# EAGLE design despertador (EAGLE 9.6.2)
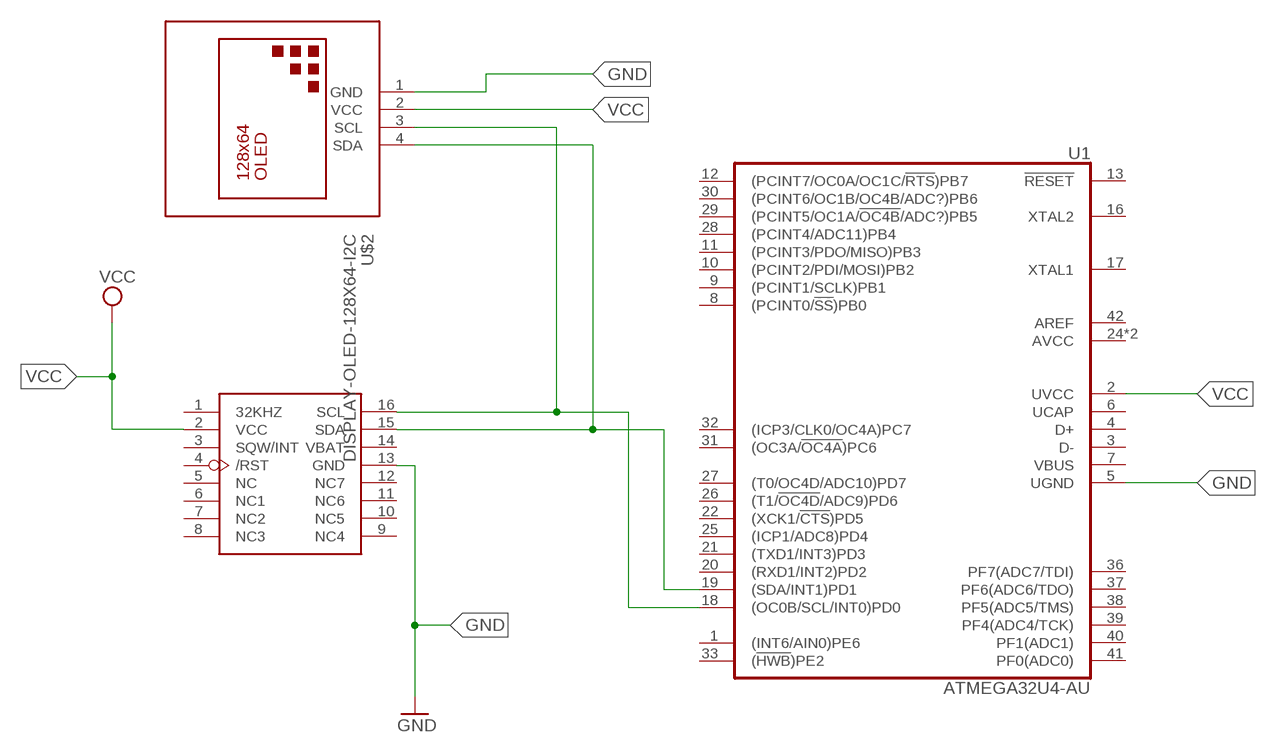
[diagram p0: schematic, sheet 1]

## Parts
U1  ATMEGA32U4-AU  [QFP44_10X10_0.80]
U$1  DS3231  [PDIP]
U$2  DISPLAY-OLED-128X64-I2C  [DISPLAY-OLED-128X64-I2C]

## Nets
GND: U1.5(UGND) U$1.13(GND) U$2.1(GND)
N$1: U1.18((OC0B/SCL/INT0)PD0) U$1.16(SCL) U$2.3(SCL)
N$2: U1.19((SDA/INT1)PD1) U$1.15(SDA) U$2.4(SDA)
VCC: U1.2(UVCC) U$1.2(VCC) U$2.2(VCC)
Unconnected: U1.1((INT6/AIN0)PE6) U1.3(D-) U1.4(D+) U1.6(UCAP) U1.7(VBUS) U1.8((PCINT0/!SS!)PB0) U1.9((PCINT1/SCLK)PB1) U1.10((PCINT2/PDI/MOSI)PB2) U1.11((PCINT3/PDO/MISO)PB3) U1.12((PCINT7/OC0A/OC1C/!RTS!)PB7) U1.13(!RESET!) U1.16(XTAL2) U1.17(XTAL1) U1.20((RXD1/INT2)PD2) U1.21((TXD1/INT3)PD3) U1.22((XCK1/!CTS!)PD5) U1.25((ICP1/ADC8)PD4) U1.26((T1/!OC4D!/ADC9)PD6) U1.27((T0/OC4D/ADC10)PD7) U1.28((PCINT4/ADC11)PB4) U1.29((PCINT5/OC1A/!OC4B!/ADC?)PB5) U1.30((PCINT6/OC1B/OC4B/ADC?)PB6) U1.31((OC3A/!OC4A!)PC6) U1.32((ICP3/CLK0/OC4A)PC7) U1.33((!HWB!)PE2) U1.36(PF7(ADC7/TDI)) U1.37(PF6(ADC6/TDO)) U1.38(PF5(ADC5/TMS)) U1.39(PF4(ADC4/TCK)) U1.40(PF1(ADC1)) U1.41(PF0(ADC0)) U1.42(AREF) U$1.1(32KHZ) U$1.3(SQW/INT) U$1.4(/RST) U$1.5(NC) U$1.6(NC1) U$1.7(NC2) U$1.8(NC3) U$1.9(NC4) U$1.10(NC5) U$1.11(NC6) U$1.12(NC7) U$1.14(VBAT)

## Power pins joined to a net without a drawn wire
AVCC: U1.24(AVCC) U1.44(AVCC)
GND: U1.15(GND) U1.23(GND) U1.35(GND) U1.43(GND)
VCC: U1.14(VCC) U1.34(VCC)

## Library data of the parts
U1 = atmel:ATMEGA*U4: 8-bit AVR Microcontroller 16/32 kbytes flash 1.25k/2.5k bytes SRAM 512/1k bytes EEPROM USART USB 2.0 ADC
U$1 = Microcontroladores:DS3231: Extremely Accurate I2C-IntegratedRTC/TCXO/Crystal \\// General Description -> The DS3231 is a low-cost, extremely accurate I2C real-time clock (RTC) with an integrated temperature-compensated crystal oscillator (TCXO) and crystal. The device incorporates a battery input, and maintains accurate timekeeping when main power to the device is interrupted. The integration of the crystal resonator enhances the long-term accuracy of the device as well as reduces the piece-part count in a manufacturing line. The DS3231 is available in commercial and industrial temperature ranges, and is offered in a 16-pin, 300-mil SO package.
U$2 = diy-modules:DISPLAY-OLED-128X64-I2C: 128x64 Dot Matrix OLED Module based on SSD1306 chip Variant with I2C interface More details available here: http://www.instructables.com/id/Monochrome-096-i2c-OLED-display-with-arduino-SSD13/ SSD1306 datasheet: https://cdn-shop.adafruit.com/datasheets/SSD1306.pdf Click here to find device on ebay.com <http://www.ebay.com/sch/oled+display+128x64+iic> Note: There are two variants: I2C and SPI. Search for the proper version.

## Board
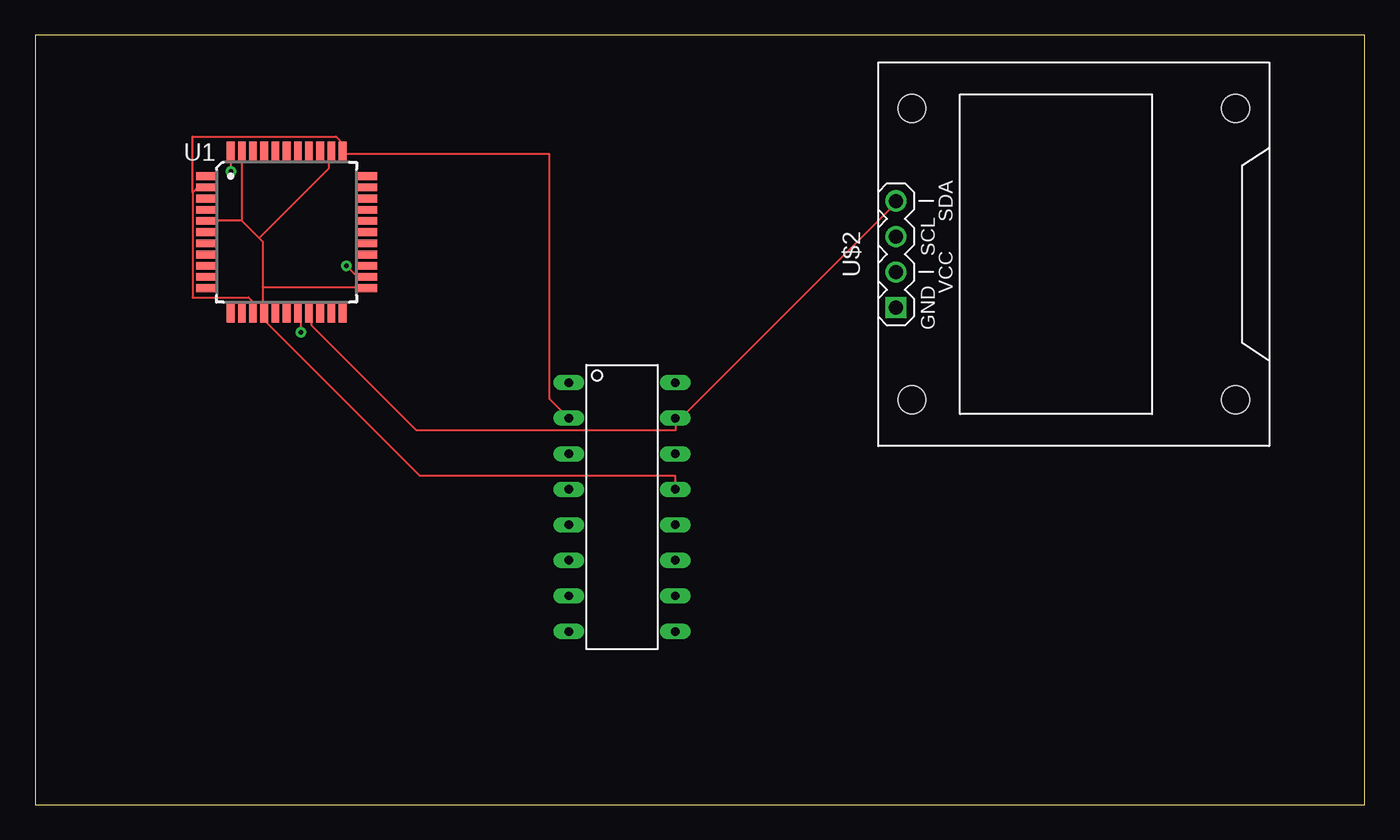
[diagram p1: board, top side]
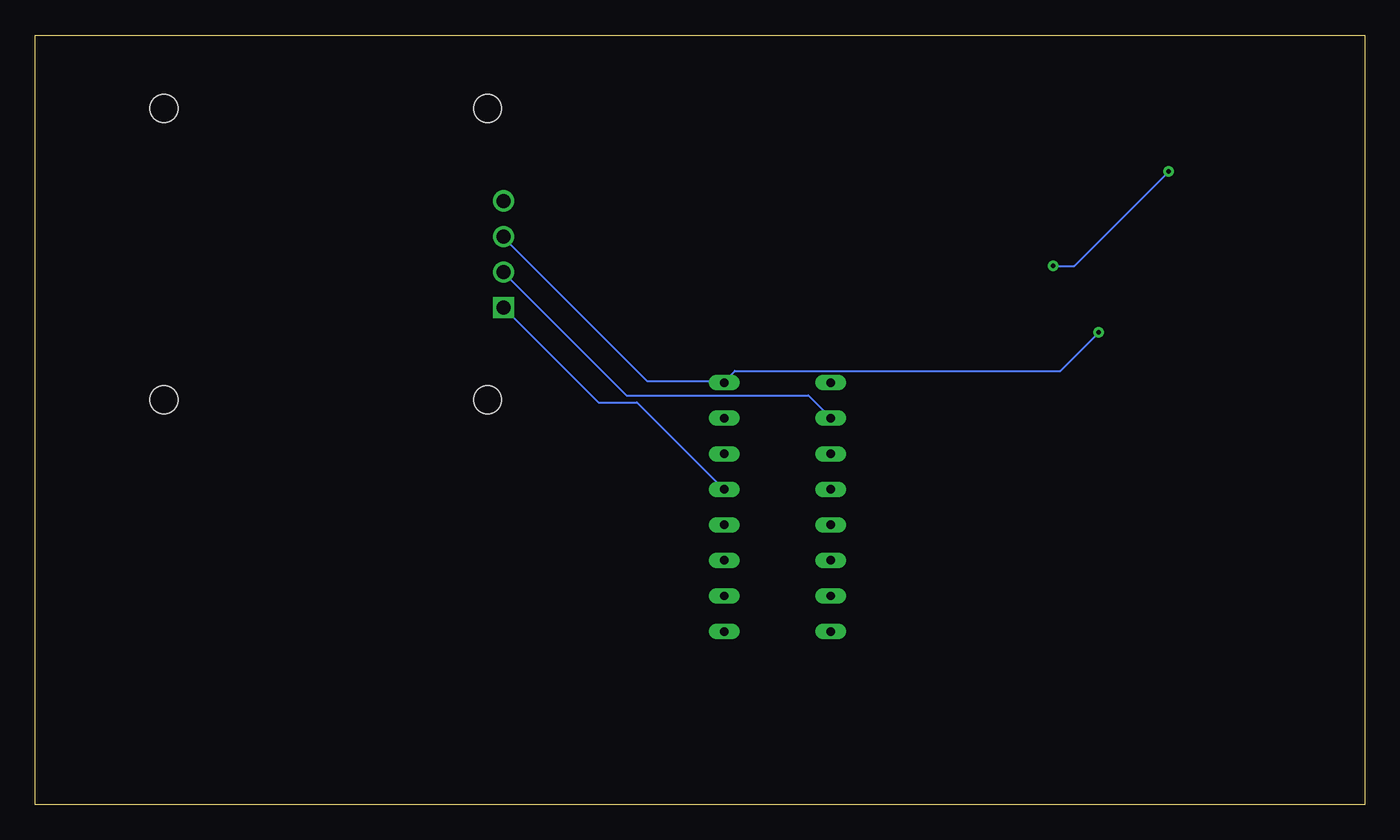
[diagram p2: board, bottom side, seen from below]

Size 95 x 55 mm. Coordinates in mm from the lower left corner, seen from the top.
Outline: 0,0 95,0 95,55 0,55 0,0
Copper layers (1*16): Top 0.035mm / dielectric 1.5mm / Bottom 0.035mm
Design rules "default": minimum track width 6mil, minimum drill 0.35mm, track to track 6mil, track to pad 6mil, pad to pad 6mil, via to via 6mil, smd to smd 6mil, copper to edge 40mil, drill to drill 6mil, minimum pad ring 10mil, minimum via ring 8mil, stop-mask expansion 4mil, vias tented up to drill 0mil, thermal gap 10mil

### Footprints (pad centres in the part's own frame; a part is rotated, then mirrored left to right if it is on the bottom)
QFP44_10X10_0.80 = smd 1.5 x 0.55: 1 -5.7,4; 2 -5.7,3.2; 3 -5.7,2.4; 4 -5.7,1.6; 5 -5.7,0.8; 6 -5.7,0; 7 -5.7,-0.8; 8 -5.7,-1.6; 9 -5.7,-2.4; 10 -5.7,-3.2; 11 -5.7,-4; 23 5.7,-4; 24 5.7,-3.2; 25 5.7,-2.4; 26 5.7,-1.6; 27 5.7,-0.8; 28 5.7,0; 29 5.7,0.8; 30 5.7,1.6; 31 5.7,2.4; 32 5.7,3.2; 33 5.7,4 | smd 0.55 x 1.5: 12 -4,-5.7; 13 -3.2,-5.7; 14 -2.4,-5.7; 15 -1.6,-5.7; 16 -0.8,-5.7; 17 0,-5.7; 18 0.8,-5.7; 19 1.6,-5.7; 20 2.4,-5.7; 21 3.2,-5.7; 22 4,-5.7; 34 4,5.7; 35 3.2,5.7; 36 2.4,5.7; 37 1.6,5.7; 38 0.8,5.7; 39 0,5.7; 40 -0.8,5.7; 41 -1.6,5.7; 42 -2.4,5.7; 43 -3.2,5.7; 44 -4,5.7
PDIP = drill 0.6 long: 1 -3.81,8.89; 2 -3.81,6.35; 3 -3.81,3.81; 4 -3.81,1.27; 5 -3.81,-1.27; 6 -3.81,-3.81; 7 -3.81,-6.35; 8 -3.81,-8.89; 9 3.81,-8.89; 10 3.81,-6.35; 11 3.81,-3.81; 12 3.81,-1.27; 13 3.81,1.27; 14 3.81,3.81; 15 3.81,6.35; 16 3.81,8.89
DISPLAY-OLED-128X64-I2C = drill 1 square: 1 -3.81,12.7 | drill 1: 2 -1.27,12.7; 3 1.27,12.7; 4 3.81,12.7 | hole 2: -10.414,11.557; 10.414,11.557; 10.414,-11.557; -10.414,-11.557

### Placement (x,y rotation side)
U1  17.98,40.91 0 top
U$1  41.95,21.26 0 top
U$2  74.22,39.33 90 top

### Tracks (layer width: path | path; a pad name or v marks a point on that pad's centre or on a via)
AVCC  (via drill 0.35)
  Top 0.152: v14,45.25 14,46.5 U1.44 | v22.25,38.5 23,37.75 23.5,37.75 U1.24
  Bottom 0.152: v14,45.25 20.75,38.5 v22.25,38.5
GND
  Top 0.152: 14.75,41.75 12.5,41.75 U1.5 | 14.75,41.75 14.75,46.5 U1.43 | 16.25,37 16.25,40.25 16,40.5 | 16.25,37 16.25,35.25 U1.15 16.5,35 16.5,34.5 27.5,23.5 45.75,23.5 45.75,22.75 U$1.13 | 14.75,41.75 16,40.5 | 16,40.5 21,45.5 21,46.5 U1.35 | 16.25,37 23.5,37 U1.23
  Bottom 0.152: U$2.1 54.75,28.75 52,28.75 46,22.75 U$1.13
N$1  (via drill 0.35)
  Top 0.152: v19,33.75 19,35 U1.18
  Bottom 0.152: v19,33.75 21.75,31 45,31 45.75,30.25 U$1.16 46,30.25 51.25,30.25 61.5,40.5 U$2.3
N$2
  Top 0.152: U1.19 19.75,35 19.75,34.25 27.25,26.75 45.75,26.75 45.75,27.5 U$1.15 46,27.5 61.5,43 U$2.4
VCC
  Top 0.152: 11.25,43.75 11.25,36.25 15.25,36.25 15.5,36 15.5,35.25 U1.14 | 11.25,43.75 11.5,44 12.25,44 U1.2 | 11.25,43.75 11.25,47.75 21.5,47.75 21.75,47.5 21.75,46.75 U1.34 22,46.5 36.75,46.5 36.75,29 U$1.2
  Bottom 0.152: U$1.2 38.25,27.75 39.75,29.25 52.75,29.25 61.5,38 U$2.2